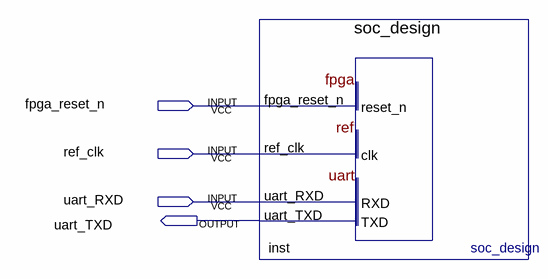
[diagram p0: schematic sheet]
// Quartus schematic chris_proj.bdf as structural Verilog: 1 symbols, 4 pins
module chris_proj (
  input  fpga_reset_n,
  input  ref_clk,
  input  uart_RXD,
  output uart_TXD
);

  soc_design inst (.fpga_reset_n(fpga_reset_n), .ref_clk(ref_clk), .uart_RXD(uart_RXD), .uart_TXD(uart_TXD));
endmodule
